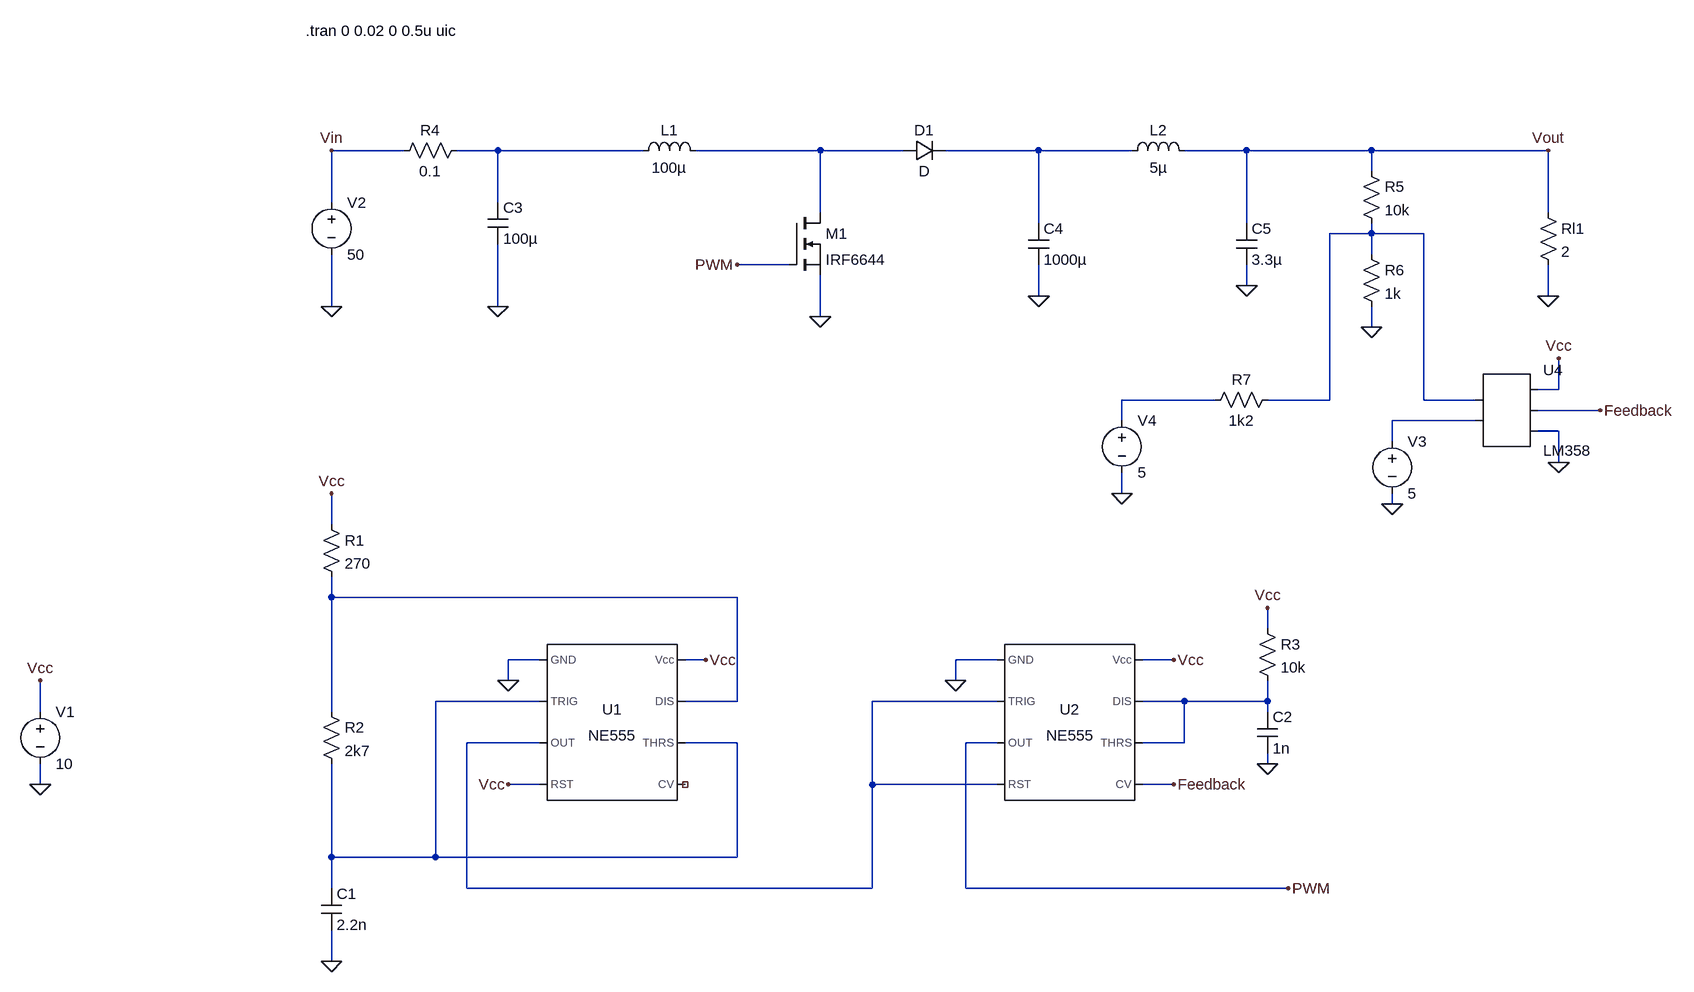
[diagram p0: schematic Boost_2.asc]
Boost_2.asc, the LTspice schematic file:
Version 4
SHEET 1 2112 1336
WIRE -208 -704 -320 -704
WIRE -64 -704 -128 -704
WIRE 160 -704 -64 -704
WIRE 432 -704 240 -704
WIRE 560 -704 432 -704
WIRE 768 -704 624 -704
WIRE 912 -704 768 -704
WIRE 1088 -704 992 -704
WIRE 1280 -704 1088 -704
WIRE 1552 -704 1280 -704
WIRE 1280 -672 1280 -704
WIRE -320 -624 -320 -704
WIRE -64 -624 -64 -704
WIRE 432 -608 432 -704
WIRE 1552 -608 1552 -704
WIRE 768 -592 768 -704
WIRE 1088 -592 1088 -704
WIRE 1280 -576 1280 -592
WIRE 1280 -576 1216 -576
WIRE 1360 -576 1280 -576
WIRE 1280 -544 1280 -576
WIRE 384 -528 304 -528
WIRE 1088 -496 1088 -528
WIRE 768 -480 768 -528
WIRE 1552 -480 1552 -528
WIRE -320 -464 -320 -544
WIRE -64 -464 -64 -560
WIRE 432 -448 432 -512
WIRE 1280 -432 1280 -464
WIRE 1568 -336 1568 -384
WIRE 1568 -336 1536 -336
WIRE 1040 -320 896 -320
WIRE 1216 -320 1216 -576
WIRE 1216 -320 1120 -320
WIRE 1360 -320 1360 -576
WIRE 1440 -320 1360 -320
WIRE 1632 -304 1536 -304
WIRE 896 -288 896 -320
WIRE 1440 -288 1312 -288
WIRE 1568 -272 1536 -272
WIRE 1312 -256 1312 -288
WIRE 1568 -224 1568 -272
WIRE 896 -176 896 -208
WIRE 1312 -160 1312 -176
WIRE -320 -128 -320 -176
WIRE -320 -16 -320 -48
WIRE 304 -16 -320 -16
WIRE 1120 32 1120 0
WIRE 0 80 -48 80
WIRE 256 80 224 80
WIRE 704 80 640 80
WIRE 976 80 928 80
WIRE -48 112 -48 80
WIRE 640 112 640 80
WIRE 0 144 -160 144
WIRE 304 144 304 -16
WIRE 304 144 224 144
WIRE 704 144 512 144
WIRE 992 144 928 144
WIRE 1120 144 1120 112
WIRE 1120 144 992 144
WIRE -768 160 -768 112
WIRE -320 160 -320 -16
WIRE 1120 160 1120 144
WIRE 0 208 -112 208
WIRE 304 208 224 208
WIRE 704 208 656 208
WIRE 992 208 992 144
WIRE 992 208 928 208
WIRE 1120 240 1120 224
WIRE -768 272 -768 240
WIRE 0 272 -48 272
WIRE 512 272 512 144
WIRE 704 272 512 272
WIRE 976 272 928 272
WIRE -320 384 -320 240
WIRE -160 384 -160 144
WIRE -160 384 -320 384
WIRE 304 384 304 208
WIRE 304 384 -160 384
WIRE -320 432 -320 384
WIRE -112 432 -112 208
WIRE 512 432 512 272
WIRE 512 432 -112 432
WIRE 656 432 656 208
WIRE 1152 432 656 432
WIRE -320 544 -320 496
FLAG -320 544 0
FLAG 1120 240 0
FLAG -768 272 0
FLAG -768 112 Vcc
FLAG 256 80 Vcc
FLAG -48 272 Vcc
FLAG -48 112 0
FLAG -320 -176 Vcc
FLAG 1120 0 Vcc
FLAG 976 80 Vcc
FLAG 640 112 0
FLAG 1152 432 PWM
FLAG 976 272 Feedback
FLAG -320 -464 0
FLAG -64 -464 0
FLAG 432 -448 0
FLAG 768 -480 0
FLAG 1552 -480 0
FLAG 1552 -704 Vout
FLAG -320 -704 Vin
FLAG 1280 -432 0
FLAG 1632 -304 Feedback
FLAG 1568 -224 0
FLAG 1568 -384 Vcc
FLAG 304 -528 PWM
FLAG 1312 -160 0
FLAG 1088 -496 0
FLAG 896 -176 0
SYMBOL Misc\\NE555 112 176 R0
SYMATTR InstName U1
SYMBOL Misc\\NE555 816 176 R0
SYMATTR InstName U2
SYMBOL res -336 -144 R0
SYMATTR InstName R1
SYMATTR Value 270
SYMBOL res -336 144 R0
SYMATTR InstName R2
SYMATTR Value 2k7
SYMBOL cap -336 432 R0
SYMATTR InstName C1
SYMATTR Value 2.2n
SYMBOL res 1104 16 R0
SYMATTR InstName R3
SYMATTR Value 10k
SYMBOL cap 1104 160 R0
SYMATTR InstName C2
SYMATTR Value 1n
SYMBOL voltage -768 144 R0
WINDOW 123 0 0 Left 0
WINDOW 39 0 0 Left 0
SYMATTR InstName V1
SYMATTR Value 10
SYMBOL cap -80 -624 R0
SYMATTR InstName C3
SYMATTR Value 100µ
SYMBOL cap 752 -592 R0
SYMATTR InstName C4
SYMATTR Value 1000µ
SYMBOL ind 144 -688 R270
WINDOW 0 32 56 VTop 2
WINDOW 3 5 56 VBottom 2
SYMATTR InstName L1
SYMATTR Value 100µ
SYMATTR SpiceLine Ipk=67
SYMBOL res 1536 -624 R0
SYMATTR InstName Rl1
SYMATTR Value 2
SYMBOL res -112 -720 R90
WINDOW 0 0 56 VBottom 2
WINDOW 3 32 56 VTop 2
SYMATTR InstName R4
SYMATTR Value 0.1
SYMBOL voltage -320 -640 R0
WINDOW 123 0 0 Left 0
WINDOW 39 0 0 Left 0
SYMATTR InstName V2
SYMATTR Value 50
SYMBOL nmos 384 -608 R0
SYMATTR InstName M1
SYMATTR Value IRF6644
SYMBOL diode 560 -688 R270
WINDOW 0 32 32 VTop 2
WINDOW 3 0 32 VBottom 2
SYMATTR InstName D1
SYMBOL res 1264 -688 R0
SYMATTR InstName R5
SYMATTR Value 10k
SYMBOL res 1264 -560 R0
SYMATTR InstName R6
SYMATTR Value 1k
SYMBOL AutoGenerated\\LM358 1504 -304 R0
SYMATTR InstName U4
SYMBOL voltage 1312 -272 R0
WINDOW 123 0 0 Left 0
WINDOW 39 0 0 Left 0
SYMATTR InstName V3
SYMATTR Value 5
SYMBOL ind 896 -688 R270
WINDOW 0 32 56 VTop 2
WINDOW 3 5 56 VBottom 2
SYMATTR InstName L2
SYMATTR Value 5µ
SYMBOL cap 1072 -592 R0
SYMATTR InstName C5
SYMATTR Value 3.3µ
SYMBOL res 1136 -336 R90
WINDOW 0 0 56 VBottom 2
WINDOW 3 32 56 VTop 2
SYMATTR InstName R7
SYMATTR Value 1k2
SYMBOL voltage 896 -304 R0
WINDOW 123 0 0 Left 0
WINDOW 39 0 0 Left 0
SYMATTR InstName V4
SYMATTR Value 5
TEXT -360 -888 Left 2 !.tran 0 0.02 0 0.5u uic

The netlist it stands for:
* Boost_2.asc
XU1 0 N008 N009 Vcc NC_01 N008 N007 Vcc NE555  ; pins GND TRIG OUT RST CV THRS DIS Vcc
XU2 0 N009 PWM N009 Feedback N010 N010 Vcc NE555  ; pins GND TRIG OUT RST CV THRS DIS Vcc
R1 Vcc N007 270
R2 N007 N008 2k7
C1 N008 0 2.2n
R3 Vcc N010 10k
C2 N010 0 1n
V1 Vcc 0 10
C3 N001 0 100µ
C4 N003 0 1000µ
L1 N001 N002 100µ Ipk=67
Rl1 Vout 0 2
R4 N001 Vin 0.1
V2 Vin 0 50
M1 N002 PWM 0 0 IRF6644
D1 N002 N003 D
R5 Vout N004 10k
R6 N004 0 1k
* U4: LM358 (symbol AutoGenerated\LM358 not available, pins judged from their places): pin1=N004 pin2=N006 pin3=Vcc pin4=Feedback pin5=0
V3 N006 0 5
L2 N003 Vout 5µ
C5 Vout 0 3.3µ
R7 N004 N005 1k2
V4 N005 0 5
.model D D
.lib standard.dio
.model NMOS NMOS
.model PMOS PMOS
.lib standard.mos
.tran 0 0.02 0 0.5u uic
.lib NE555.sub
.backanno
.end